# EAGLE schematic rtiduino (EAGLE 6.5.0)

## Sheet 1 of 4
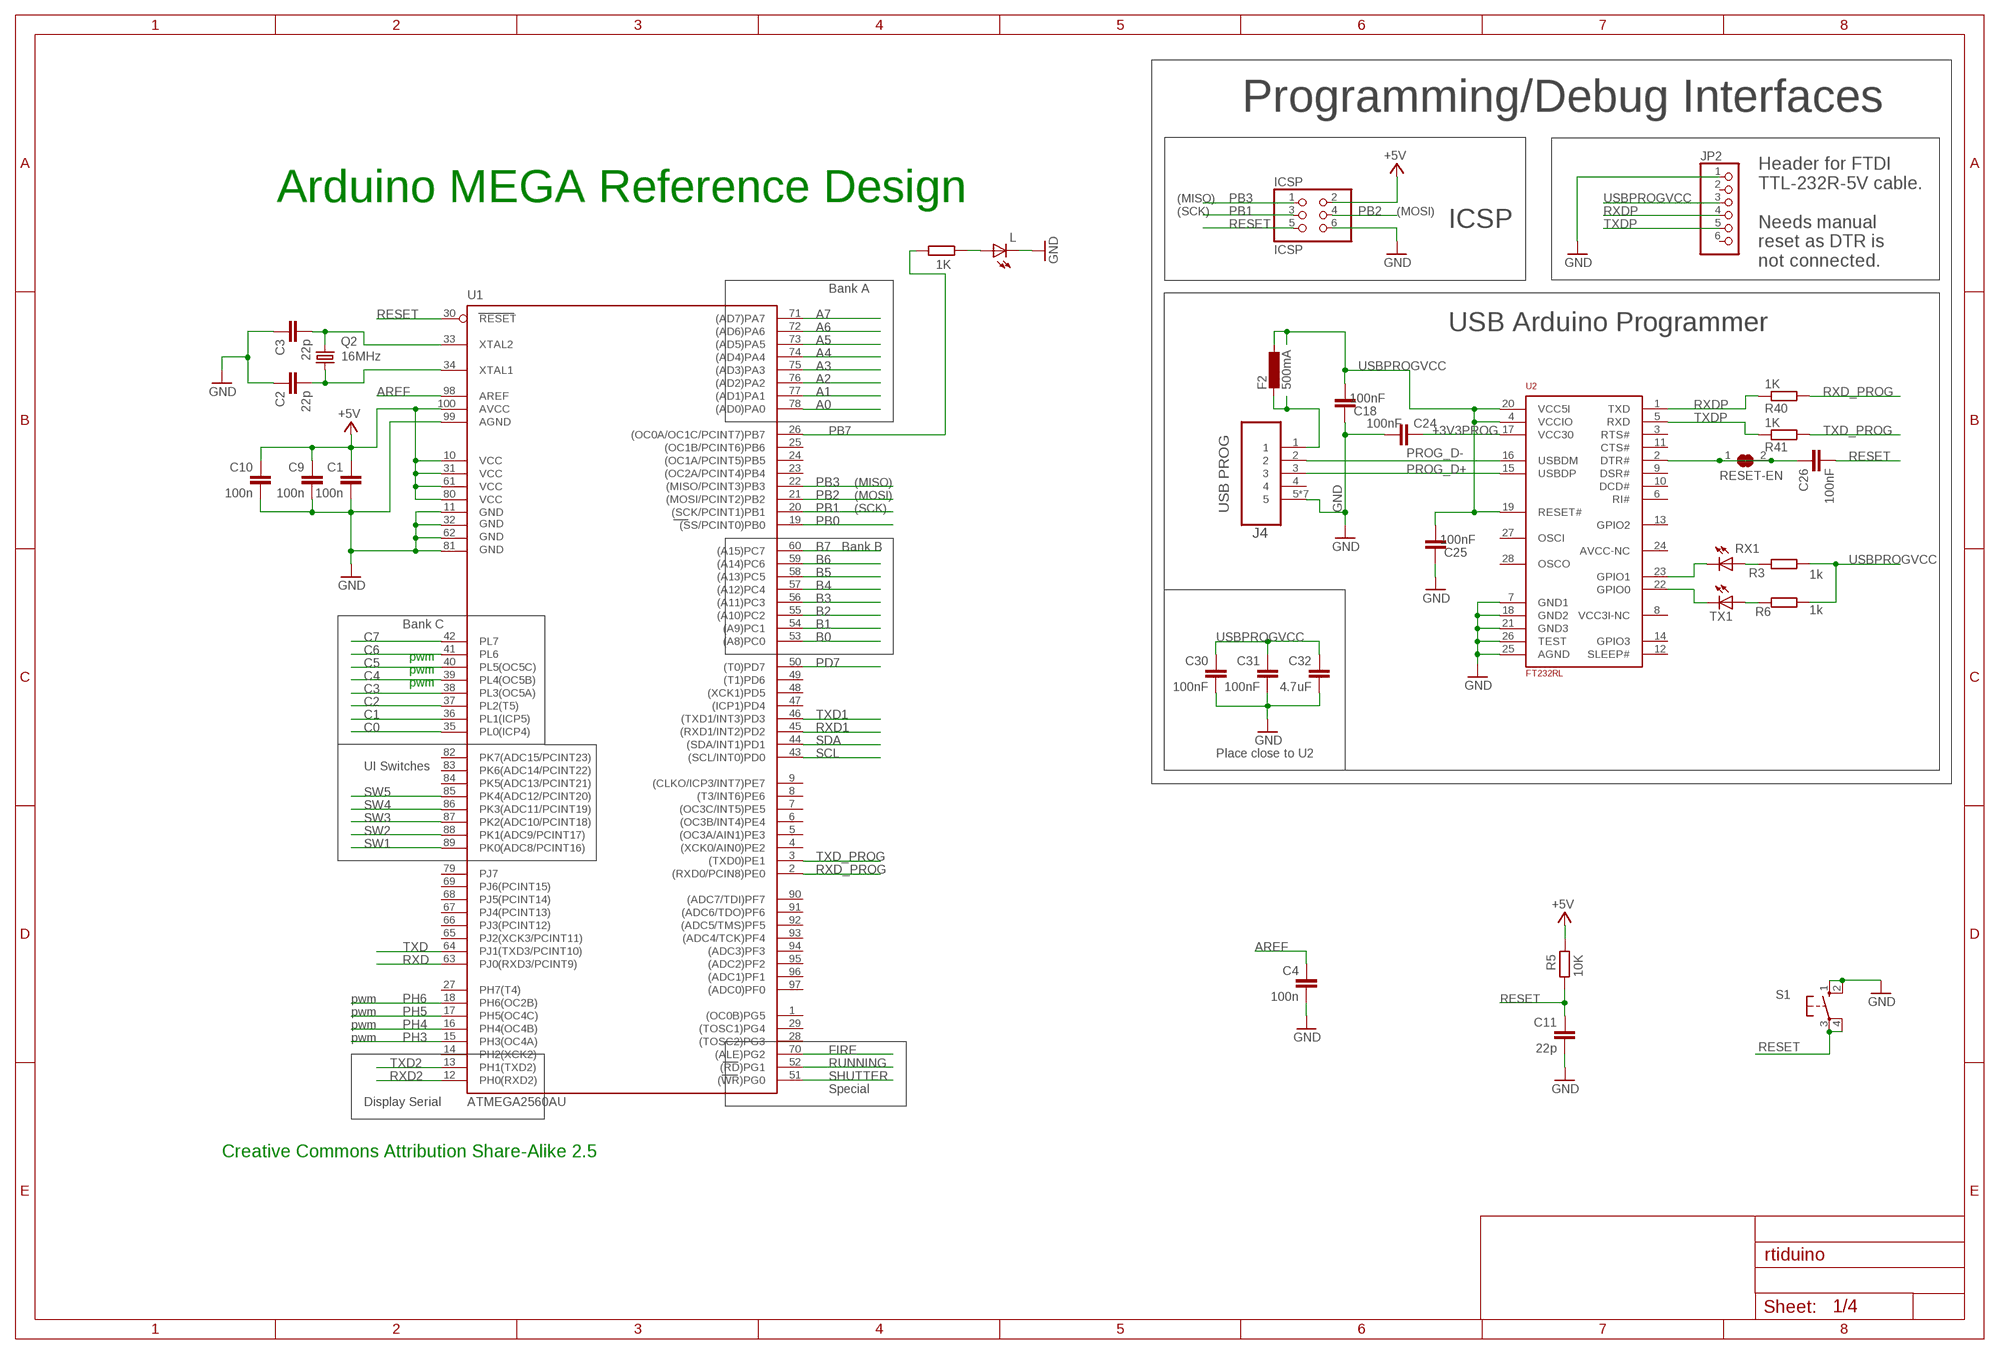
[diagram p0: schematic, sheet 1]

### Parts
C1  100n  C-EUC0805K  [C0805K]
C2  22p  C-EUC0805K  [C0805K]
C3  22p  C-EUC0805K  [C0805K]
C4  100n  C-EUC0805K  [C0805K]
C9  100n  C-EUC0805K  [C0805K]
C10  100n  C-EUC0805K  [C0805K]
C11  22p  C-EUC0805K  [C0805K]
C18  100nF  C-EUC0805K  [C0805K]
C24  100nF  C-EUC0805K  [C0805K]
C25  100nF  C-EUC0805K  [C0805K]
C26  100nF  C-EUC0805K  [C0805K]
C30  100nF  C-EUC0805K  [C0805K]
C31  100nF  C-EUC0805K  [C0805K]
C32  4.7uF  C-EUC0805K  [C0805K]
F2  500mA  L-EUL1812  [L1812]
ICSP  ICSP  PINHD-2X3  [2X03]
J4  USB PROG  47346-0001  [MOLEX_47346-0001]
JP2  PINHD-1X6  [1X06]
L  LED0805ROUND  [0805RND]
Q2  16MHz  CRYTALHC49S  [HC49/S]
R1  1K  R-EU_R0805  [R0805]
R3  1k  R-EU_R0805  [R0805]
R5  10K  R-EU_R0805  [R0805]
R6  1k  R-EU_R0805  [R0805]
R40  1K  R-EU_R0805  [R0805]
R41  1K  R-EU_R0805  [R0805]
RESET-EN  SJ  [SJ]
RX1  LED0805ROUND  [0805RND]
S1  10-XX  [B3F-10XX]
TX1  LED0805ROUND  [0805RND]
U1  ATMEGA2560AU  [TQFP100]
U2  FT232RL  [SSOP28]

### Nets
+3V3PROG [power]: C24.2 U2.17(VCC30)
+5V [usbvcc]: C1.1 C9.1 C10.1 ICSP.2 R5.2 U1.10(VCC) U1.31(VCC1) U1.61(VCC2) U1.80(VCC3) U1.100(AVCC) ; also sheet 2,4
A0: U1.78((AD0)PA0) ; also sheet 3
A1: U1.77((AD1)PA1) ; also sheet 3
A2: U1.76((AD2)PA2) ; also sheet 3
A3: U1.75((AD3)PA3) ; also sheet 3
A4: U1.74((AD4)PA4) ; also sheet 3
A5: U1.73((AD5)PA5) ; also sheet 3
A6: U1.72((AD6)PA6) ; also sheet 3
A7: U1.71((AD7)PA7) ; also sheet 3
AREF: C4.1 U1.98(AREF)
B0: U1.53((A8)PC0) ; also sheet 3
B1: U1.54((A9)PC1) ; also sheet 3
B2: U1.55((A10)PC2) ; also sheet 3
B3: U1.56((A11)PC3) ; also sheet 3
B4: U1.57((A12)PC4) ; also sheet 3
B5: U1.58((A13)PC5) ; also sheet 3
B6: U1.59((A14)PC6) ; also sheet 3
B7: U1.60((A15)PC7) ; also sheet 3
C0: U1.35(PL0(ICP4)) ; also sheet 3
C1: U1.36(PL1(ICP5)) ; also sheet 3
C2: U1.37(PL2(T5)) ; also sheet 3
C3: U1.38(PL3(OC5A)) ; also sheet 3
C4: U1.39(PL4(OC5B)) ; also sheet 3
C5: U1.40(PL5(OC5C)) ; also sheet 3
C6: U1.41(PL6) ; also sheet 3
C7: U1.42(PL7) ; also sheet 3
FIRE: U1.70((ALE)PG2) ; also sheet 2
GND [gnd]: C1.2 C2.1 C3.1 C4.2 C9.2 C10.2 C11.2 C18.2 C24.1 C25.2 C30.2 C31.2 C32.2 ICSP.6 J4.5 J4.M1 J4.M2 J4.M3 J4.M4 J4.M5 J4.M6 JP2.1 L.P$2(C) S1.1(S) S1.2(S1) U1.11(GND) U1.32(GND1) U1.62(GND2) U1.81(GND3) U1.99(AGND) U2.7(GND1) U2.18(GND2) U2.21(GND3) U2.25(AGND) U2.26(TEST) ; also sheet 2,3,4
N$2: L.P$1(A) R1.2
N$6: C2.2 Q2.1 U1.34(XTAL1)
N$7: C3.2 Q2.2 U1.33(XTAL2)
N$50: RX1.P$2(C) U2.23(GPIO1)
N$52: TX1.P$2(C) U2.22(GPIO0)
N$58: R3.1 RX1.P$1(A)
N$62: R6.1 TX1.P$1(A)
N$63 [usbvcc]: F2.2 J4.1
N$66: C26.1 RESET-EN.1 RESET-EN.2 U2.2(DTR#)
PB0: U1.19((SS/PCINT0)PB0)
PB1: ICSP.3 U1.20((SCK/PCINT1)PB1)
PB2: ICSP.4 U1.21((MOSI/PCINT2)PB2)
PB3: ICSP.1 U1.22((MISO/PCINT3)PB3)
PB7: R1.1 U1.26((OC0A/OC1C/PCINT7)PB7)
PD7: U1.50((T0)PD7)
PH3: U1.15(PH3(OC4A))
PH4: U1.16(PH4(OC4B))
PH5: U1.17(PH5(OC4C))
PH6: U1.18(PH6(OC2B))
PROG_D+: J4.3 U2.15(USBDP)
PROG_D-: J4.2 U2.16(USBDM)
RESET: C11.1 C26.2 ICSP.5 R5.1 S1.3(P) S1.4(P1) U1.30(RESET)
RUNNING: U1.52((RD)PG1) ; also sheet 2
RXD: U1.63(PJ0(RXD3/PCINT9)) ; also sheet 2
RXD1: U1.45((RXD1/INT2)PD2)
RXD2: U1.12(PH0(RXD2)) ; also sheet 2
RXD_PROG: R40.2 U1.2((RXD0/PCIN8)PE0)
RXDP: JP2.4 R40.1 U2.1(TXD)
SCL: U1.43((SCL/INT0)PD0) ; also sheet 2
SDA: U1.44((SDA/INT1)PD1) ; also sheet 2
SHUTTER: U1.51((WR)PG0) ; also sheet 2
SW1: U1.89(PK0(ADC8/PCINT16)) ; also sheet 2
SW2: U1.88(PK1(ADC9/PCINT17)) ; also sheet 2
SW3: U1.87(PK2(ADC10/PCINT18)) ; also sheet 2
SW4: U1.86(PK3(ADC11/PCINT19)) ; also sheet 2
SW5: U1.85(PK4(ADC12/PCINT20)) ; also sheet 2
TXD: U1.64(PJ1(TXD3/PCINT10)) ; also sheet 2
TXD1: U1.46((TXD1/INT3)PD3)
TXD2: U1.13(PH1(TXD2)) ; also sheet 2
TXD_PROG: R41.2 U1.3((TXD0)PE1)
TXDP: JP2.5 R41.1 U2.5(RXD)
USBPROGVCC [usbvcc]: C18.1 C25.1 C30.1 C31.1 C32.1 F2.1 JP2.3 R3.2 R6.2 U2.4(VCCIO) U2.19(RESET#) U2.20(VCC5I) ; also sheet 4
Unconnected: J4.4 JP2.2 JP2.6 U1.1((OC0B)PG5) U1.4((XCK0/AIN0)PE2) U1.5((OC3A/AIN1)PE3) U1.6((OC3B/INT4)PE4) U1.7((OC3C/INT5)PE5) U1.8((T3/INT6)PE6) U1.9((CLKO/ICP3/INT7)PE7) U1.14(PH2(XCK2)) U1.23((OC2A/PCINT4)PB4) U1.24((OC1A/PCINT5)PB5) U1.25((OC1B/PCINT6)PB6) U1.27(PH7(T4)) U1.28((TOSC2)PG3) U1.29((TOSC1)PG4) U1.47((ICP1)PD4) U1.48((XCK1)PD5) U1.49((T1)PD6) U1.65(PJ2(XCK3/PCINT11)) U1.66(PJ3(PCINT12)) U1.67(PJ4(PCINT13)) U1.68(PJ5(PCINT14)) U1.69(PJ6(PCINT15)) U1.79(PJ7) U1.82(PK7(ADC15/PCINT23)) U1.83(PK6(ADC14/PCINT22)) U1.84(PK5(ADC13/PCINT21)) U1.90((ADC7/TDI)PF7) U1.91((ADC6/TDO)PF6) U1.92((ADC5/TMS)PF5) U1.93((ADC4/TCK)PF4) U1.94((ADC3)PF3) U1.95((ADC2)PF2) U1.96((ADC1)PF1) U1.97((ADC0)PF0) U2.3(RTS#) U2.6(RI#) U2.8(VCC3I-NC) U2.9(DSR#) U2.10(DCD#) U2.11(CTS#) U2.12(SLEEP#) U2.13(GPIO2) U2.14(GPIO3) U2.24(AVCC-NC) U2.27(OSCI) U2.28(OSCO)

### Notes on the sheet
- Programming/Debug Interfaces
- Arduino MEGA Reference Design | (MISO)
- (SCK) | (MOSI)
- ICSP
- Header for FTDI
  TTL-232R-5V cable.
  
  Needs manual 
  reset as DTR is 
  not connected.
- Bank A
- USB Arduino Programmer
- (MISO)
- (MOSI)
- (SCK)
- Bank B
- Bank C
- pwm
- pwm
- pwm
- Place close to U2
- UI Switches
- pwm
- pwm
- pwm
- pwm
- Special
- Display Serial
- Creative Commons Attribution Share-Alike 2.5

## Sheet 2 of 4: UI & Control
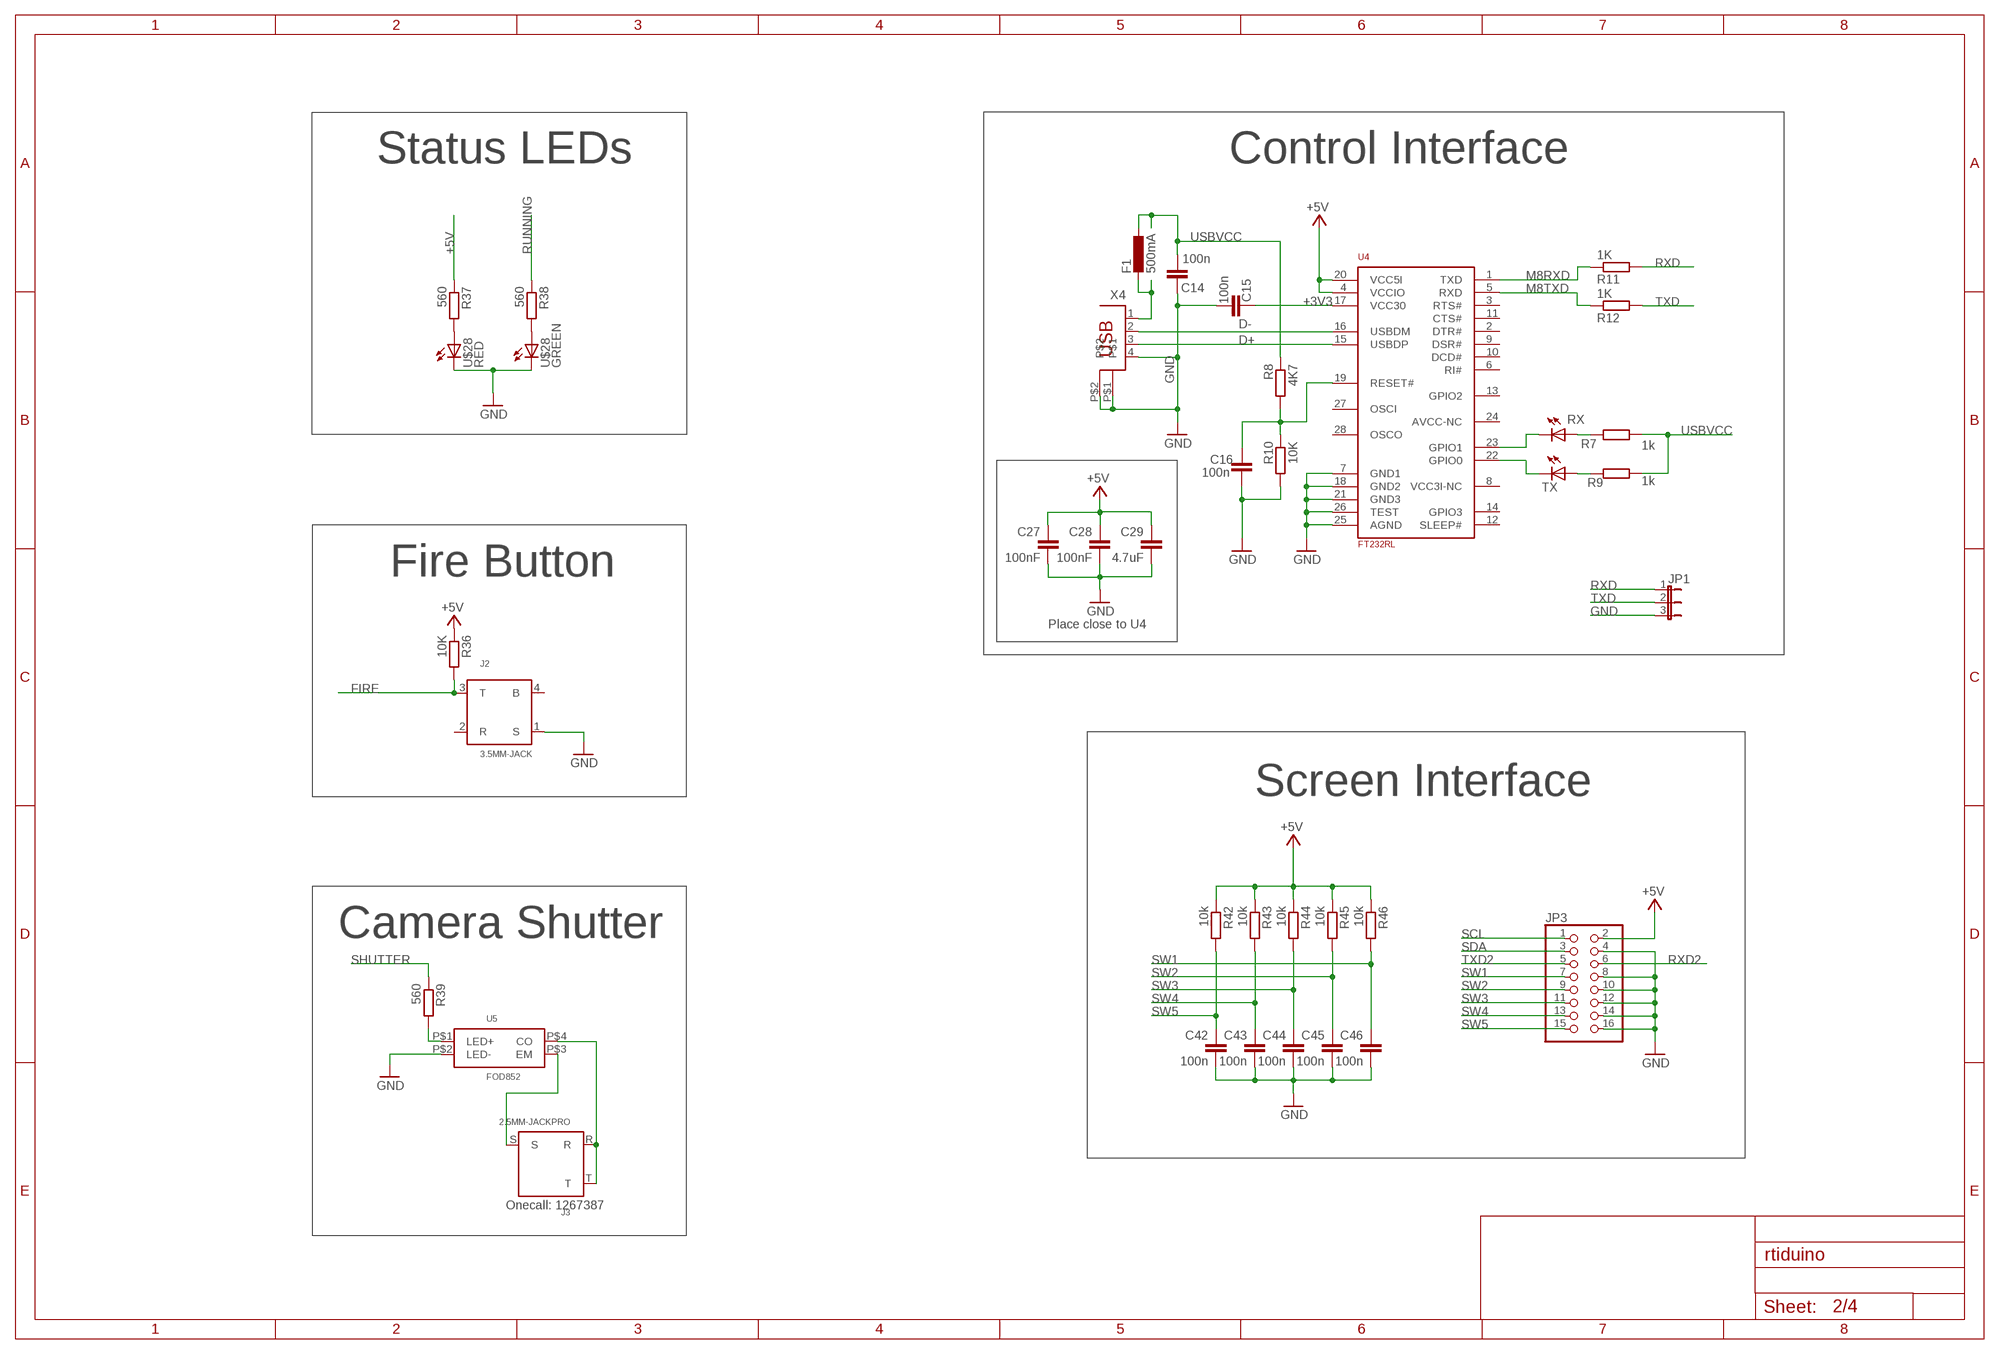
[diagram p1: schematic, sheet 2]

### Parts
C14  100n  C-EUC0805K  [C0805K]
C15  100n  C-EUC0805K  [C0805K]
C16  100n  C-EUC0805K  [C0805K]
C27  100nF  C-EUC0805K  [C0805K]
C28  100nF  C-EUC0805K  [C0805K]
C29  4.7uF  C-EUC0805K  [C0805K]
C42  100n  C-EUC0805K  [C0805K]
C43  100n  C-EUC0805K  [C0805K]
C44  100n  C-EUC0805K  [C0805K]
C45  100n  C-EUC0805K  [C0805K]
C46  100n  C-EUC0805K  [C0805K]
F1  500mA  L-EUL1812  [L1812]
J2  3.5MM-JACK  [3.5-JACK-RA]
J3  2.5MM-JACKPRO  [2.5-JACK-RA-PRO]
JP1  JP2E  [JP2]
JP3  PINHD-2X8  [2X08]
R7  1k  R-EU_R0805  [R0805]
R8  4K7  R-EU_R0805  [R0805]
R9  1k  R-EU_R0805  [R0805]
R10  10K  R-EU_R0805  [R0805]
R11  1K  R-EU_R0805  [R0805]
R12  1K  R-EU_R0805  [R0805]
R36  10K  R-EU_R0805  [R0805]
R37  560  R-EU_R0805  [R0805]
R38  560  R-EU_R0805  [R0805]
R39  560  R-EU_R0805  [R0805]
R42  10k  R-EU_R0805  [R0805]
R43  10k  R-EU_R0805  [R0805]
R44  10k  R-EU_R0805  [R0805]
R45  10k  R-EU_R0805  [R0805]
R46  10k  R-EU_R0805  [R0805]
RX  LED0805ROUND  [0805RND]
TX  LED0805ROUND  [0805RND]
U4  FT232RL  [SSOP28]
U5  FOD852  [DIP4-SMD]
U$28  122-000-04-52  [122-000-04-52]
X4  PN61729  [PN61729]

### Nets
+3V3 [power]: C15.2 U4.17(VCC30)
+5V [usbvcc]: C27.1 C28.1 C29.1 JP3.2 R36.1 R37.1 R42.1 R43.1 R44.1 R45.1 R46.1 U4.4(VCCIO) U4.20(VCC5I) ; also sheet 1,4
D+: U4.15(USBDP) X4.3
D-: U4.16(USBDM) X4.2
FIRE: J2.3(T) R36.2 ; also sheet 1
GND [gnd]: C14.2 C15.1 C16.1 C27.2 C28.2 C29.2 C42.2 C43.2 C44.2 C45.2 C46.2 J2.1(S) JP1.3 JP3.4 JP3.8 JP3.10 JP3.12 JP3.14 JP3.16 R10.2 U4.7(GND1) U4.18(GND2) U4.21(GND3) U4.25(AGND) U4.26(TEST) U5.P$2(LED-) U$28.P$1(RC) U$28.P$3(GC) X4.4 X4.P$1 X4.P$2 ; also sheet 1,3,4
M8RXD: R11.1 U4.1(TXD)
M8TXD: R12.1 U4.5(RXD)
N$15: RX.P$2(C) U4.23(GPIO1)
N$51: J3.R J3.T U5.P$4(CO)
N$53: TX.P$2(C) U4.22(GPIO0)
N$54: R7.1 RX.P$1(A)
N$55: R9.1 TX.P$1(A)
N$56: R37.2 U$28.P$2(RA)
N$57: R38.2 U$28.P$4(GA)
N$59: R39.2 U5.P$1(LED+)
N$60 [usbvcc]: F1.2 X4.1
N$61: J3.S U5.P$3(EM)
N$68: C16.2 R8.2 R10.1 U4.19(RESET#)
RUNNING: R38.1 ; also sheet 1
RXD: JP1.1 R11.2 ; also sheet 1
RXD2: JP3.6 ; also sheet 1
SCL: JP3.1 ; also sheet 1
SDA: JP3.3 ; also sheet 1
SHUTTER: R39.1 ; also sheet 1
SW1: C46.1 JP3.7 R46.2 ; also sheet 1
SW2: C45.1 JP3.9 R45.2 ; also sheet 1
SW3: C44.1 JP3.11 R44.2 ; also sheet 1
SW4: C43.1 JP3.13 R43.2 ; also sheet 1
SW5: C42.1 JP3.15 R42.2 ; also sheet 1
TXD: JP1.2 R12.2 ; also sheet 1
TXD2: JP3.5 ; also sheet 1
USBVCC [usbvcc]: C14.1 F1.1 R7.2 R8.1 R9.2 ; also sheet 4
Unconnected: J2.2(R) J2.4(B) U4.2(DTR#) U4.3(RTS#) U4.6(RI#) U4.8(VCC3I-NC) U4.9(DSR#) U4.10(DCD#) U4.11(CTS#) U4.12(SLEEP#) U4.13(GPIO2) U4.14(GPIO3) U4.24(AVCC-NC) U4.27(OSCI) U4.28(OSCO)

### Notes on the sheet
- Status LEDs | Control Interface
- Fire Button
- Place close to U4
- Screen Interface
- Camera Shutter
- Onecall: 1267387

## Sheet 3 of 4: LED Control Matrix
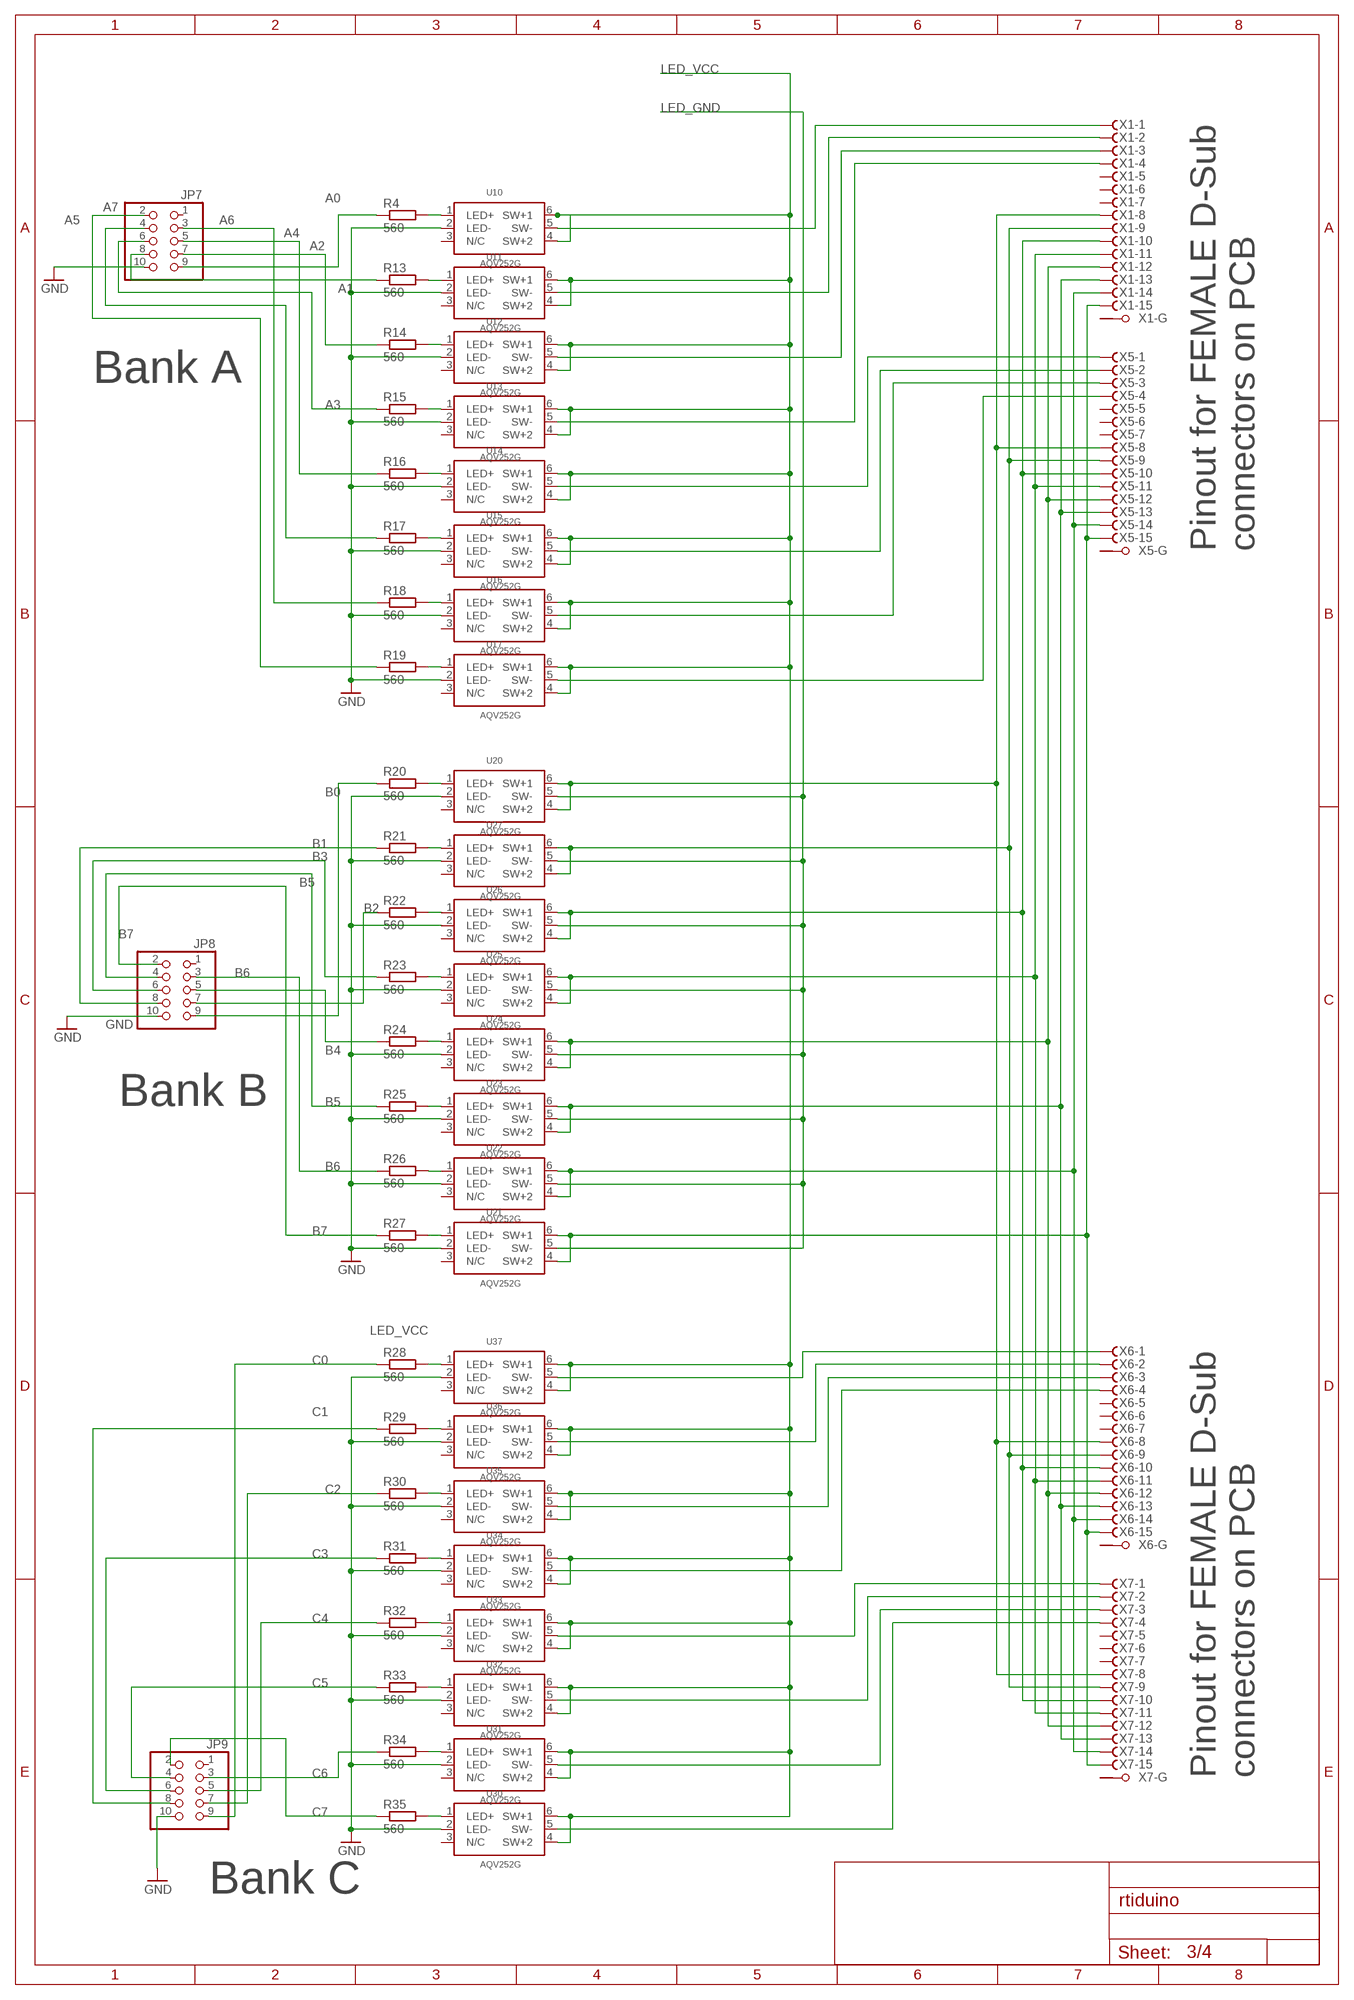
[diagram p2: schematic, sheet 3]

### Parts
JP7  PINHD-2X5  [2X05]
JP8  PINHD-2X5  [2X05]
JP9  PINHD-2X5  [2X05]
R4  560  R-EU_R0805  [R0805]
R13  560  R-EU_R0805  [R0805]
R14  560  R-EU_R0805  [R0805]
R15  560  R-EU_R0805  [R0805]
R16  560  R-EU_R0805  [R0805]
R17  560  R-EU_R0805  [R0805]
R18  560  R-EU_R0805  [R0805]
R19  560  R-EU_R0805  [R0805]
R20  560  R-EU_R0805  [R0805]
R21  560  R-EU_R0805  [R0805]
R22  560  R-EU_R0805  [R0805]
R23  560  R-EU_R0805  [R0805]
R24  560  R-EU_R0805  [R0805]
R25  560  R-EU_R0805  [R0805]
R26  560  R-EU_R0805  [R0805]
R27  560  R-EU_R0805  [R0805]
R28  560  R-EU_R0805  [R0805]
R29  560  R-EU_R0805  [R0805]
R30  560  R-EU_R0805  [R0805]
R31  560  R-EU_R0805  [R0805]
R32  560  R-EU_R0805  [R0805]
R33  560  R-EU_R0805  [R0805]
R34  560  R-EU_R0805  [R0805]
R35  560  R-EU_R0805  [R0805]
U10  AQV252G  [SOP6]
U11  AQV252G  [SOP6]
U12  AQV252G  [SOP6]
U13  AQV252G  [SOP6]
U14  AQV252G  [SOP6]
U15  AQV252G  [SOP6]
U16  AQV252G  [SOP6]
U17  AQV252G  [SOP6]
U20  AQV252G  [SOP6]
U21  AQV252G  [SOP6]
U22  AQV252G  [SOP6]
U23  AQV252G  [SOP6]
U24  AQV252G  [SOP6]
U25  AQV252G  [SOP6]
U26  AQV252G  [SOP6]
U27  AQV252G  [SOP6]
U30  AQV252G  [SOP6]
U31  AQV252G  [SOP6]
U32  AQV252G  [SOP6]
U33  AQV252G  [SOP6]
U34  AQV252G  [SOP6]
U35  AQV252G  [SOP6]
U36  AQV252G  [SOP6]
U37  AQV252G  [SOP6]
X1  F15HPS  [F15HP]
X5  F15HPS  [F15HP]
X6  F15HPS  [F15HP]
X7  F15HPS  [F15HP]

### Nets
A0: JP7.9 R4.1 ; also sheet 1
A1: JP7.8 R13.1 ; also sheet 1
A2: JP7.7 R14.1 ; also sheet 1
A3: JP7.6 R15.1 ; also sheet 1
A4: JP7.5 R16.1 ; also sheet 1
A5: JP7.4 R17.1 ; also sheet 1
A6: JP7.3 R18.1 ; also sheet 1
A7: JP7.2 R19.1 ; also sheet 1
B0: JP8.9 R20.1 ; also sheet 1
B1: JP8.8 R21.1 ; also sheet 1
B2: JP8.7 R22.1 ; also sheet 1
B3: JP8.6 R23.1 ; also sheet 1
B4: JP8.5 R24.1 ; also sheet 1
B5: JP8.4 R25.1 ; also sheet 1
B6: JP8.3 R26.1 ; also sheet 1
B7: JP8.2 R27.1 ; also sheet 1
C0: JP9.9 R28.1 ; also sheet 1
C1: JP9.8 R29.1 ; also sheet 1
C2: JP9.7 R30.1 ; also sheet 1
C3: JP9.6 R31.1 ; also sheet 1
C4: JP9.5 R32.1 ; also sheet 1
C5: JP9.4 R33.1 ; also sheet 1
C6: JP9.3 R34.1 ; also sheet 1
C7: JP9.2 R35.1 ; also sheet 1
GND [gnd]: JP7.10 JP8.10 JP9.10 U10.2(LED-) U11.2(LED-) U12.2(LED-) U13.2(LED-) U14.2(LED-) U15.2(LED-) U16.2(LED-) U17.2(LED-) U20.2(LED-) U21.2(LED-) U22.2(LED-) U23.2(LED-) U24.2(LED-) U25.2(LED-) U26.2(LED-) U27.2(LED-) U30.2(LED-) U31.2(LED-) U32.2(LED-) U33.2(LED-) U34.2(LED-) U35.2(LED-) U36.2(LED-) U37.2(LED-) ; also sheet 1,2,4
LED_GND: U20.5(SW-) U21.5(SW-) U22.5(SW-) U23.5(SW-) U24.5(SW-) U25.5(SW-) U26.5(SW-) U27.5(SW-) ; also sheet 4
LED_VCC: U10.4(SW+2) U10.6(SW+1) U11.4(SW+2) U11.6(SW+1) U12.4(SW+2) U12.6(SW+1) U13.4(SW+2) U13.6(SW+1) U14.4(SW+2) U14.6(SW+1) U15.4(SW+2) U15.6(SW+1) U16.4(SW+2) U16.6(SW+1) U17.4(SW+2) U17.6(SW+1) U30.4(SW+2) U30.6(SW+1) U31.4(SW+2) U31.6(SW+1) U32.4(SW+2) U32.6(SW+1) U33.4(SW+2) U33.6(SW+1) U34.4(SW+2) U34.6(SW+1) U35.4(SW+2) U35.6(SW+1) U36.4(SW+2) U36.6(SW+1) U37.4(SW+2) U37.6(SW+1) ; also sheet 4
N$1: R4.2 U10.1(LED+)
N$5: R14.2 U12.1(LED+)
N$8: R15.2 U13.1(LED+)
N$9: R18.2 U16.1(LED+)
N$10: R16.2 U14.1(LED+)
N$11: U14.5(SW-) X5.1(-1:F)
N$12: R17.2 U15.1(LED+)
N$13: R13.2 U11.1(LED+)
N$14: U31.5(SW-) X7.3(-3:F)
N$16: R19.2 U17.1(LED+)
N$17: R28.2 U37.1(LED+)
N$18: R29.2 U36.1(LED+)
N$19: R30.2 U35.1(LED+)
N$20: R31.2 U34.1(LED+)
N$21: R32.2 U33.1(LED+)
N$22: R33.2 U32.1(LED+)
N$23: R34.2 U31.1(LED+)
N$24: R35.2 U30.1(LED+)
N$25: R20.2 U20.1(LED+)
N$26: R21.2 U27.1(LED+)
N$27: R22.2 U26.1(LED+)
N$28: R23.2 U25.1(LED+)
N$29: R24.2 U24.1(LED+)
N$30: R25.2 U23.1(LED+)
N$31: R26.2 U22.1(LED+)
N$32: R27.2 U21.1(LED+)
N$33: U10.5(SW-) X1.1(-1:F)
N$34: U37.5(SW-) X6.1(-1:F)
N$35: U11.5(SW-) X1.2(-2:F)
N$36: U12.5(SW-) X1.3(-3:F)
N$37: U13.5(SW-) X1.4(-4:F)
N$38: U35.5(SW-) X6.3(-3:F)
N$39: U34.5(SW-) X6.4(-4:F)
N$40: U33.5(SW-) X7.1(-1:F)
N$41: U32.5(SW-) X7.2(-2:F)
N$42: U30.5(SW-) X7.4(-4:F)
N$45: U15.5(SW-) X5.2(-2:F)
N$46: U16.5(SW-) X5.3(-3:F)
N$47: U17.5(SW-) X5.4(-4:F)
N$49: U36.5(SW-) X6.2(-2:F)
ROW1: U20.4(SW+2) U20.6(SW+1) X1.8(-8:F) X5.8(-8:F) X6.8(-8:F) X7.8(-8:F)
ROW2: U27.4(SW+2) U27.6(SW+1) X1.9(-9:F) X5.9(-9:F) X6.9(-9:F) X7.9(-9:F)
ROW3: U26.4(SW+2) U26.6(SW+1) X1.10(-10:F) X5.10(-10:F) X6.10(-10:F) X7.10(-10:F)
ROW4: U25.4(SW+2) U25.6(SW+1) X1.11(-11:F) X5.11(-11:F) X6.11(-11:F) X7.11(-11:F)
ROW5: U24.4(SW+2) U24.6(SW+1) X1.12(-12:F) X5.12(-12:F) X6.12(-12:F) X7.12(-12:F)
ROW6: U23.4(SW+2) U23.6(SW+1) X1.13(-13:F) X5.13(-13:F) X6.13(-13:F) X7.13(-13:F)
ROW7: U22.4(SW+2) U22.6(SW+1) X1.14(-14:F) X5.14(-14:F) X6.14(-14:F) X7.14(-14:F)
ROW8: U21.4(SW+2) U21.6(SW+1) X1.15(-15:F) X5.15(-15:F) X6.15(-15:F) X7.15(-15:F)
Unconnected: JP7.1 JP8.1 JP9.1 U10.3(N/C) U11.3(N/C) U12.3(N/C) U13.3(N/C) U14.3(N/C) U15.3(N/C) U16.3(N/C) U17.3(N/C) U20.3(N/C) U21.3(N/C) U22.3(N/C) U23.3(N/C) U24.3(N/C) U25.3(N/C) U26.3(N/C) U27.3(N/C) U30.3(N/C) U31.3(N/C) U32.3(N/C) U33.3(N/C) U34.3(N/C) U35.3(N/C) U36.3(N/C) U37.3(N/C) X1.5(-5:F) X1.6(-6:F) X1.7(-7:F) X1.G1(-G:G1) X1.G2(-G:G2) X5.5(-5:F) X5.6(-6:F) X5.7(-7:F) X5.G1(-G:G1) X5.G2(-G:G2) X6.5(-5:F) X6.6(-6:F) X6.7(-7:F) X6.G1(-G:G1) X6.G2(-G:G2) X7.5(-5:F) X7.6(-6:F) X7.7(-7:F) X7.G1(-G:G1) X7.G2(-G:G2)

### Notes on the sheet
- Bank A
- Pinout for FEMALE D-Sub
  connectors on PCB
- Bank B
- Pinout for FEMALE D-Sub
  connectors on PCB
- Bank C

## Sheet 4 of 4: Power
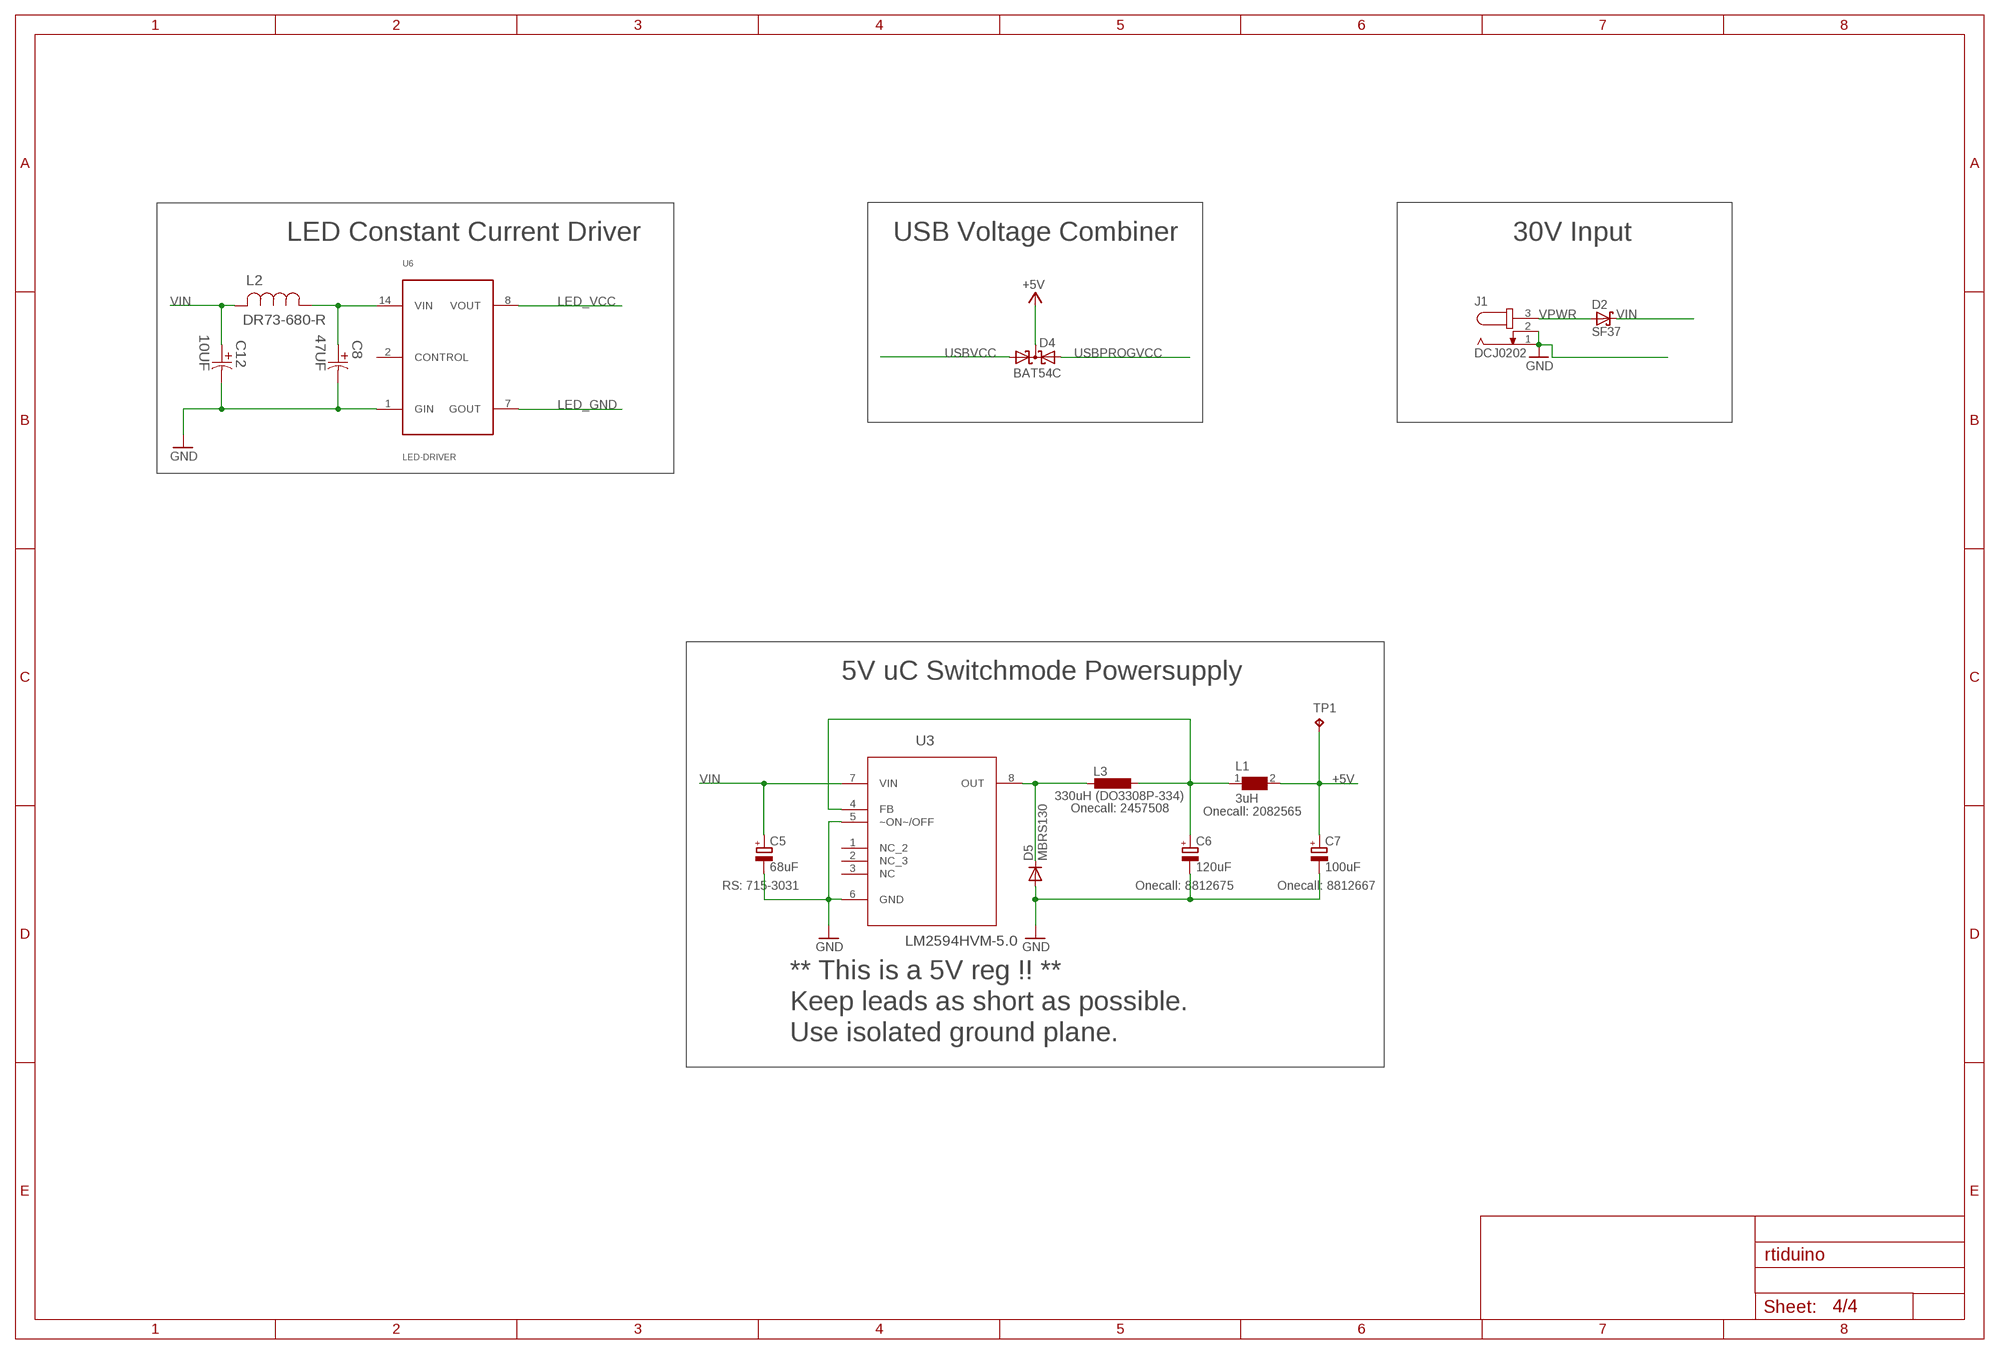
[diagram p3: schematic, sheet 4]

### Parts
C5  68uF  CPOL-EUE5-13  [E5-13]
C6  120uF  CPOL-EUE5-13  [E5-13]
C7  100uF  CPOL-EUE5-13  [E5-13]
C8  47UF  EEE-FK1J470P-CASE-F  [CAPAE830X1050N]
C12  10UF  EEE-FK1J100P-CASE-D  [CAPAE660X610N]
D2  SF37  [DO-201AD]
D4  BAT54C  [SOT23]
D5  MBRS130  DIODE-DO214AA  [DO214AA]
J1  DCJ0202  JACK-PLUG0  [SPC4077]
L1  3uH  WE-TPC-744053003_5818/5828  [WE-TPC_5818/5828]
L2  DR73-680-R  [INDM7676X355N]
L3  330uH (DO3308P-334)  DO3316P  [DO3316P]
TP1  TPB2,54  [B2,54]
U3  LM2594HVM-5.0  LM2594HVM-3.3  [SOIC127P620X175-8N]
U6  LED-DRIVER  [LDU08]

### Nets
+5V [usbvcc]: C7.+ D4.3(CC) L1.2 TP1.TP ; also sheet 1,2
GND [gnd]: C5.- C6.- C7.- C8.2 C12.2 D5.A J1.1 J1.2 U3.5(~ON~/OFF) U3.6(GND) U6.1(GIN) ; also sheet 1,2,3
LED_GND: U6.7(GOUT) ; also sheet 3
LED_VCC: U6.8(VOUT) ; also sheet 3
N$4 [usbvcc]: C6.+ L1.1 L3.2 U3.4(FB)
N$43: C8.1 L2.1 U6.14(VIN)
N$48: D5.C L3.1 U3.8(OUT)
USBPROGVCC [usbvcc]: D4.2(A2) ; also sheet 1
USBVCC [usbvcc]: D4.1(A1) ; also sheet 2
VIN [power]: C5.+ C12.1 D2.1(C) L2.2 U3.7(VIN)
VPWR [power]: D2.2(A) J1.3
Unconnected: U3.1(NC_2) U3.2(NC_3) U3.3(NC) U6.2(CONTROL)

### Notes on the sheet
- LED Constant Current Driver | USB Voltage Combiner | 30V Input
- 5V uC Switchmode Powersupply
- Onecall: 2457508 | Onecall: 2082565
- RS: 715-3031 | Onecall: 8812675 | Onecall: 8812667
- ** This is a 5V reg !! **
  Keep leads as short as possible.
  Use isolated ground plane.

## Library data of the parts
C1-C4 C9-C11 C14-C16 C18 C24-C32 C42-C46 = rcl:C-EU: CAPACITOR, European symbol
C5-C7 = rcl:CPOL-EU: POLARIZED CAPACITOR, European symbol
C8 = RTI:EEE-: Aluminum Electrolytic Capacitors,Surface Mount Type; MPN: EEE-FK1J470P; OC_FARNELL: 9696032; OC_NEWARK: 96K9403; PACKAGE: CASE-F; SUPPLIER: PANASONIC; TOLERANCE: ±20 %; VOLTAGERATING: 63 V
C12 = RTI:EEE-: Aluminum Electrolytic Capacitors,Surface Mount Type; MPN: EEE-FK1J100P; OC_FARNELL: 9696008; OC_NEWARK: 96K9398; PACKAGE: CASE-D; SUPPLIER: PANASONIC; TOLERANCE: ±20 %; VOLTAGERATING: 63 V
D2 = farnell-parts:SF37
D4 = diode:BAT54C: Schottky Diodes Source: Fairchild .. BAT54.pdf
D5 = diode:DIODE-: DIODE
F1 F2 = rcl:L-EU: INDUCTOR, European symbol
ICSP = pinhead:PINHD-2X3: PIN HEADER
J1 = con-jack:JACK-PLUG: DC POWER JACK Power Jack, DC, Right Angle, Through Hole, Rated 5A at 16VDC, PC Terminals Distributor: Farnell (www.Farnell.de) Drawing: 84N1161.pdf / 84N1162.pdf Manufacturer: SPC Technology (www.spctechnology.com) Type: SPC4077 / SPC 4078; OC_FARNELL: unknown; OC_NEWARK: unknown
J2 = RTI:3.5MM-JACK
J3 = RTI:2.5MM-JACK
J4 = CC11x:47346-0001: CONN RCPT 5POS MICRO USB R/A SMD; MPN: 47346-0001; OC_FARNELL: 1568026; OC_NEWARK: 47M0505; PACKAGE: 5 POS MICRO USB R/A; SUPPLIER: MOLEX
JP1 = jumper:JP2E: JUMPER
JP2 = pinhead:PINHD-1X6: PIN HEADER
JP3 = pinhead:PINHD-2X8: PIN HEADER
JP7-JP9 = pinhead:PINHD-2X5: PIN HEADER
L RX RX1 TX TX1 = led:LED: LED OSRAM: - CHIPLED LG R971, LG N971, LY N971, LG Q971, LY Q971, LO R971, LY R971 LH N974, LH R974 LS Q976, LO Q976, LY Q976 LO Q996 - Hyper CHIPLED LW Q18S LB Q993, LB Q99A, LB R99A - SideLED LS A670, LO A670, LY A670, LG A670, LP A670 LB A673, LV A673, LT A673, LW A673 LH A674 LY A675 LS A676, LA A676, LO A676, LY A676, LW A676 LS A679, LY A679, LG A679 - Hyper Micro SIDELED® LS Y876, LA Y876, LO Y876, LY Y876 LT Y87S - SmartLED LW L88C, LW L88S LB L89C, LB L89S, LG L890 LS L89K, LO L89K, LY L89K LS L896, LA L896, LO L896, LY L896 - TOPLED LS T670, LO T670, LY T670, LG T670, LP T670 LSG T670, LSP T670, LSY T670, LOP T670, LYG T670 LG T671, LOG T671, LSG T671 LB T673, LV T673, LT T673, LW T673 LH T674 LS T676, LA T676, LO T676, LY T676, LB T676, LH T676, LSB T676, LW T676 LB T67C, LV T67C, LT T67C, LS T67K, LO T67K, LY T67K, LW E67C LS E67B, LA E67B, LO E67B, LY E67B, LB E67C, LV E67C, LT E67C LW T67C LS T679, LY T679, LG T679 LS T770, LO T770, LY T770, LG T770, LP T770 LB T773, LV T773, LT T773, LW T773 LH T774 LS E675, LA E675, LY E675, LS T675 LS T776, LA T776, LO T776, LY T776, LB T776 LHGB T686 LT T68C, LB T68C - Hyper Mini TOPLED® LB M676 - Mini TOPLED Santana® LG M470 LS M47K, LO M47K, LY M47K Source: http://www.osram.convergy.de/
L1 = RTI:WE-TPC: Shielded Tiny Power Inductor WE-TPC - Extremely flat power inductor - High current capability - High reliability and perfect soldering characteristics because of integrated soldering pad - magnetically shielded -- Portable power like PDA, digital camera, PCMICA-cards and displays -- DC/DC-converter -- Recommended for switching regulator IC's from Linear Technology, National Semiconductor, Texas Instruments and Fairchild Semiconductor; MPN: 744053003; OC_FARNELL: 2082565; OC_NEWARK: 88T7010; PACKAGE: 5828; SUPPLIER: WURTH ELEKTRONIK
L2 = RTI:DR73-680-R: POWER INDUCTOR; CURRENTRATING: 890mA; INDUCTANCE: 68µH; MPN: DR73-680-R; OC_FARNELL: 1653721; OC_NEWARK: 52K7562; PACKAGE: SMD; SUPPLIER: COILTRONICS; TOLERANCE: ±20%
L3 = inductor-coilcraft:DO3316P: COILCRAFT; OC_FARNELL: unknown; OC_NEWARK: unknown
Q2 = crystal:CRYTAL: CRYSTAL
R1 R3-R7 R9 R13-R35 = rcl:R-EU_: RESISTOR, European symbol
R8 R10-R12 R36-R46 = resistor:R-EU_: RESISTOR, European symbol
RESET-EN = jumper:SJ: SMD solder JUMPER
S1 = switch-omron:10-XX: OMRON SWITCH
TP1 = testpad:TP: Test pad
U1 = SparkFun:ATMEGA2560: MICROCONTROLLER 64/128/256 Kbytes FLASH 4 Kbytes EEPROM 8 Kbytes SRAM 86 General Purpose I/O pins 12-channels16-bit PWM 4 x Serial USARTs 16-channels 10-bit A/D
U2 U4 = SmartPrj:FT232RL
U3 = RTI:LM2594HVM-3.3: SIMPLE SWITCHER; MPN: LM2594HVM-33; OC_FARNELL: 1564635; OC_NEWARK: 41K3809; PACKAGE: SOIC-8; SUPPLIER: National Semiconductor
U5 = RTI:FOD852
U6 = RTI:LED-DRIVER
U10-U17 U20-U27 U30-U37 = RTI:AQV252G
U$28 = RTI:122-000-04-52
X1 X5-X7 = con-subd:F15HPS: SUB-D
X4 = SmartPrj:PN61729: BERG USB connector

## Net classes
0 default: width 0.203 mm, drill 0.2 mm, clearance 0.127 mm
1 power: width 0.203 mm, drill 0.2 mm, clearance 0.127 mm
2 gnd: width 0.203 mm, drill 0.2 mm, clearance 0.127 mm
3 usbvcc: width 0.203 mm, drill 0.2 mm, clearance 0.127 mm